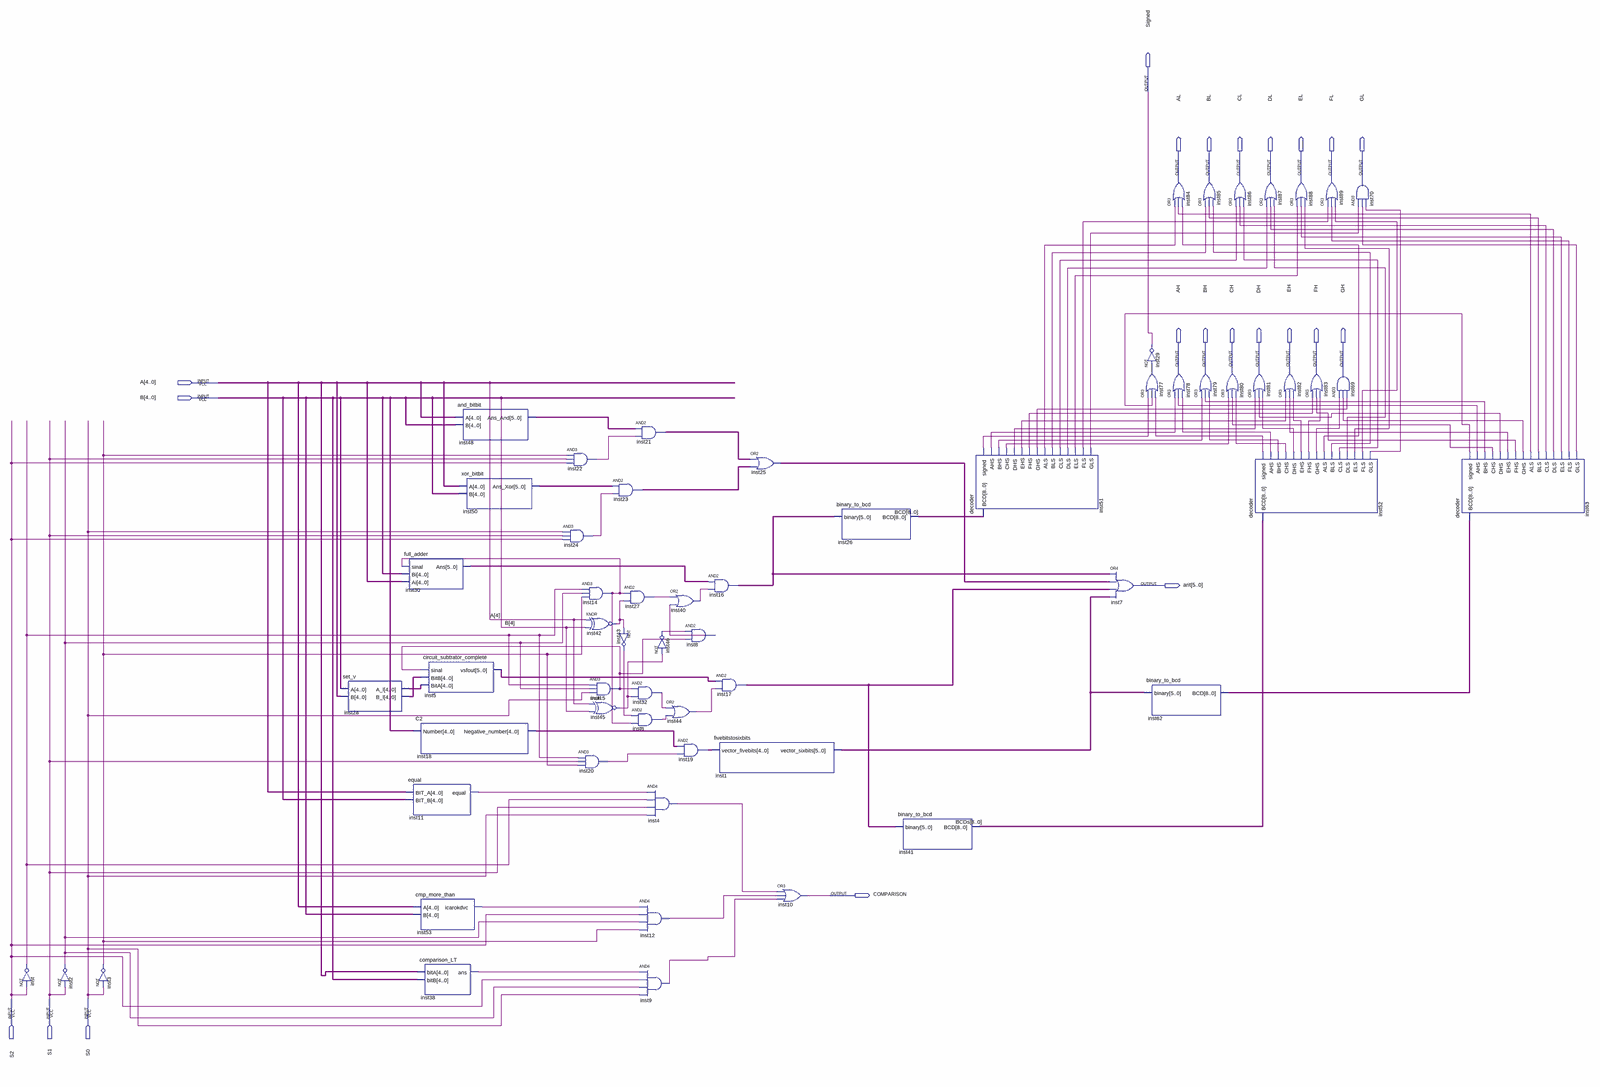
[diagram p0: schematic sheet, whole]
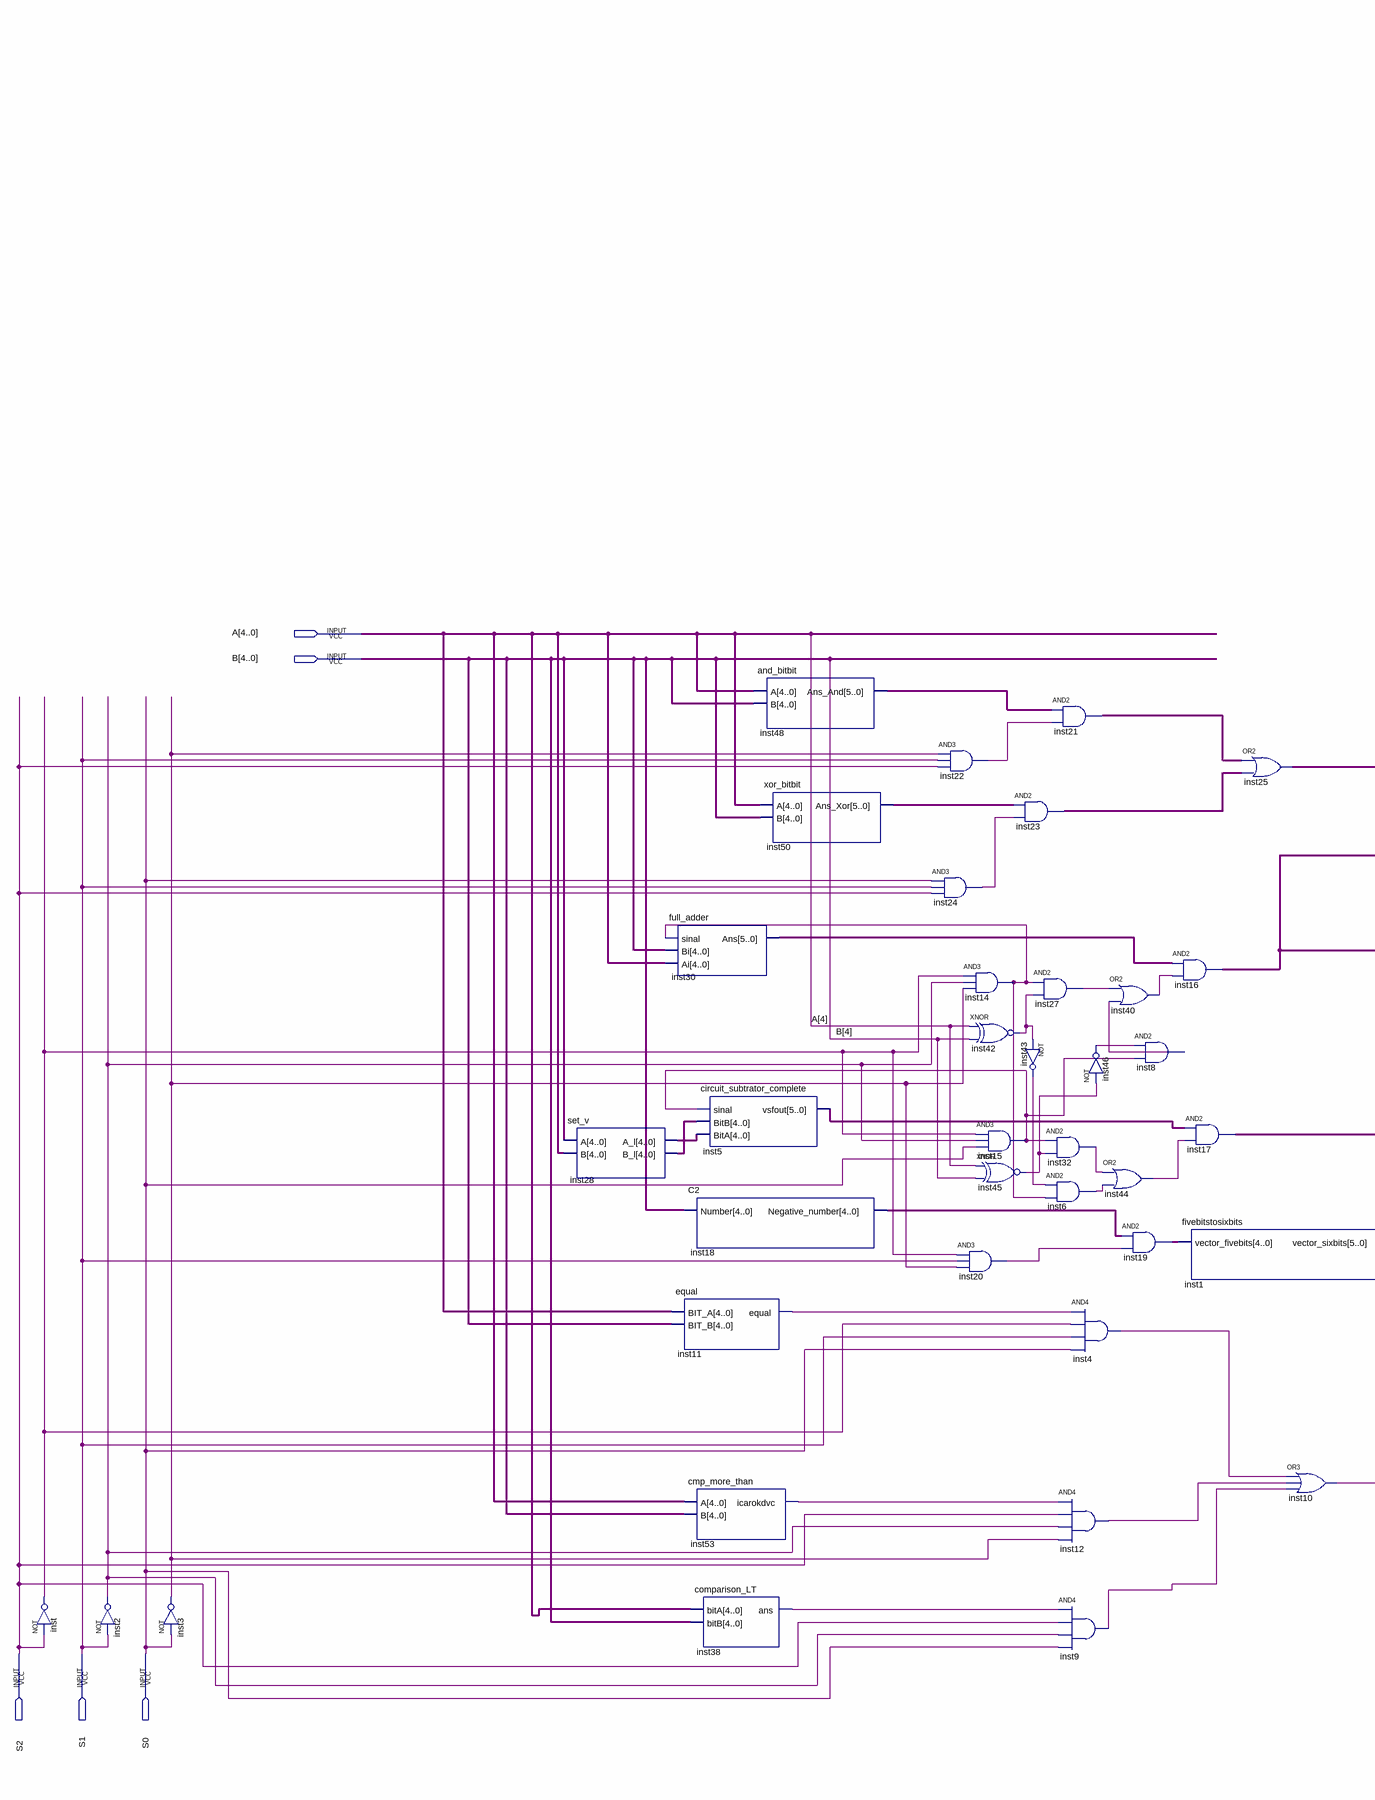
[diagram p1: schematic sheet, left part]
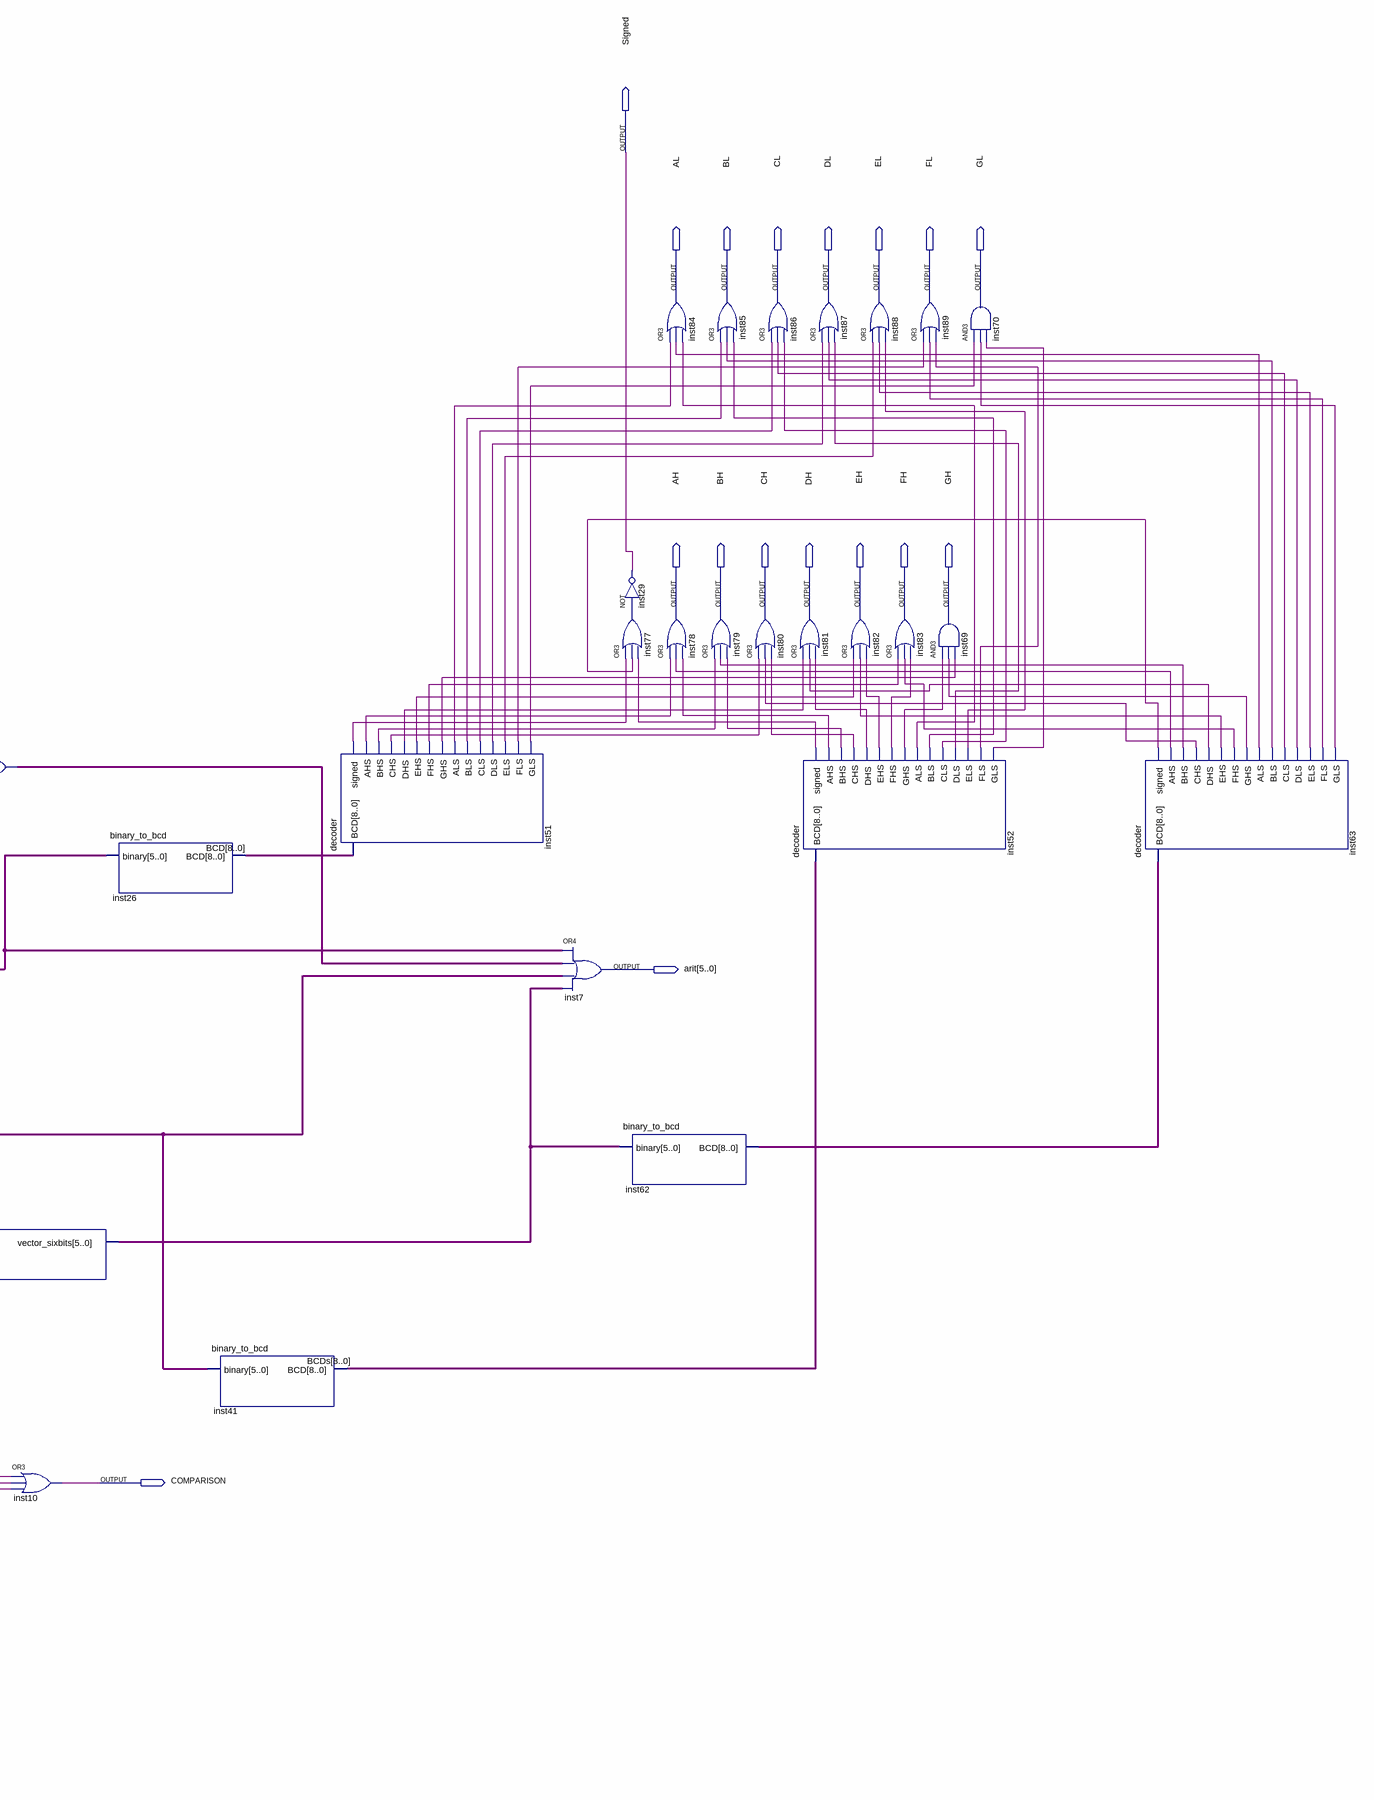
[diagram p2: schematic sheet, right part]
// Quartus schematic ula.bdf as structural Verilog: 61 symbols, 22 pins
module ula (
  input  [4:0] A,
  input  [4:0] B,
  input  S2,
  input  S1,
  input  S0,
  output Signed,
  output AL,
  output BL,
  output CL,
  output DL,
  output EL,
  output FL,
  output GL,
  output AH,
  output BH,
  output CH,
  output DH,
  output EH,
  output FH,
  output GH,
  output [5:0] arit,
  output COMPARISON
);

  wire inst2_out, inst3_out, inst4_out, inst6_out, inst8_out, inst9_out, inst11_equal, inst12_out,
       inst14_out, inst15_out, inst20_out, inst22_out, inst24_out, inst27_out, inst32_out, inst38_ans,
       inst40_out, inst42_out, inst43_out, inst44_out, inst45_out, inst46_out, inst51_ahs, inst51_als,
       inst51_bhs, inst51_bls, inst51_chs, inst51_cls, inst51_dhs, inst51_dls, inst51_ehs, inst51_els,
       inst51_fhs, inst51_fls, inst51_ghs, inst51_gls, inst51_signed, inst52_ahs, inst52_als, inst52_bhs,
       inst52_bls, inst52_chs, inst52_cls, inst52_dhs, inst52_dls, inst52_ehs, inst52_els, inst52_fhs,
       inst52_fls, inst52_ghs, inst52_gls, inst52_signed, inst53_icarokdvc, inst63_ahs, inst63_als,
       inst63_bhs, inst63_bls, inst63_chs, inst63_cls, inst63_dhs, inst63_dls, inst63_ehs, inst63_els,
       inst63_fhs, inst63_fls, inst63_ghs, inst63_gls, inst63_signed, inst77_out, inst_out;
  wire [4:0] inst18_negative_number, inst19_out, inst28_a_l, inst28_b_l;
  wire [5:0] inst1_vector_sixbits, inst5_vsfout, inst16_out, inst17_out, inst21_out, inst23_out, inst25_out,
       inst30_ans, inst48_ans_and, inst50_ans_xor;
  wire [8:0] BCD, BCDs, inst62_bcd;

  not inst (inst_out, S2);
  not inst2 (inst2_out, S1);
  not inst3 (inst3_out, S0);
  set_v inst28 (.A(B), .B(A), .A_l(inst28_a_l), .B_l(inst28_b_l));
  full_adder inst30 (.sinal(inst14_out), .Bi(B), .Ai(A), .Ans(inst30_ans));
  circuit_subtrator_complete inst5 (.sinal(inst15_out), .BitB(inst28_b_l), .BitA(inst28_a_l), .vsfout(inst5_vsfout));
  C2 inst18 (.Number(B), .Negative_number(inst18_negative_number));
  equal inst11 (.BIT_A(A), .BIT_B(B), .equal(inst11_equal));
  cmp_more_than inst53 (.A(A), .B(B), .icarokdvc(inst53_icarokdvc));
  comparison_LT inst38 (.bitA(A), .bitB(B), .ans(inst38_ans));
  and_bitbit inst48 (.A(A), .B(B), .Ans_And(inst48_ans_and));
  xor_bitbit inst50 (.A(A), .B(B), .Ans_Xor(inst50_ans_xor));
  and inst22 (inst22_out, inst3_out, S1, S2);
  and inst24 (inst24_out, S0, S1, S2);
  and inst20 (inst20_out, inst_out, S1, inst3_out);
  and inst14 (inst14_out, inst_out, inst2_out, inst3_out);
  xnor inst42 (inst42_out, A[4], B[4]);
  and inst15 (inst15_out, inst_out, inst2_out, S0);
  xnor inst45 (inst45_out, A[4], B[4]);
  assign inst21_out = inst48_ans_and & {6{inst22_out}};  // AND2 inst21, 6 bits wide
  assign inst23_out = inst50_ans_xor & {6{inst24_out}};  // AND2 inst23, 6 bits wide
  and inst27 (inst27_out, inst14_out, inst42_out);
  not inst43 (inst43_out, inst42_out);
  and inst32 (inst32_out, inst15_out, inst45_out);
  and inst6 (inst6_out, inst43_out, inst14_out);
  and inst12 (inst12_out, inst53_icarokdvc, S2, inst2_out, inst3_out);
  and inst9 (inst9_out, inst38_ans, S2, inst2_out, S0);
  or inst40 (inst40_out, inst27_out, inst8_out);
  not inst46 (inst46_out, inst45_out);
  or inst44 (inst44_out, inst32_out, inst6_out);
  and inst4 (inst4_out, inst11_equal, inst_out, S1, S0);
  and inst8 (inst8_out, inst46_out, inst15_out);
  assign inst19_out = inst18_negative_number & {5{inst20_out}};  // AND2 inst19, 5 bits wide
  assign inst16_out = inst30_ans & {6{inst40_out}};  // AND2 inst16, 6 bits wide
  assign inst17_out = inst5_vsfout & {6{inst44_out}};  // AND2 inst17, 6 bits wide
  fivebitstosixbits inst1 (.vector_fivebits(inst19_out), .vector_sixbits(inst1_vector_sixbits));
  assign inst25_out = inst21_out | inst23_out;  // OR2 inst25, 6 bits wide
  or inst10 (COMPARISON, inst4_out, inst12_out, inst9_out);
  binary_to_bcd inst26 (.binary(inst16_out), .BCD(BCD));
  binary_to_bcd inst41 (.binary(inst17_out), .BCD(BCDs));
  decoder inst51 (
    .BCD(BCD), .\signed (inst51_signed), .AHS(inst51_ahs), .BHS(inst51_bhs), .CHS(inst51_chs),
    .DHS(inst51_dhs), .EHS(inst51_ehs), .FHS(inst51_fhs), .GHS(inst51_ghs), .ALS(inst51_als),
    .BLS(inst51_bls), .CLS(inst51_cls), .DLS(inst51_dls), .ELS(inst51_els), .FLS(inst51_fls), .GLS(inst51_gls));
  assign arit = inst16_out | inst25_out | inst17_out | inst1_vector_sixbits;  // OR4 inst7, 6 bits wide
  not inst29 (Signed, inst77_out);
  or inst77 (inst77_out, inst51_signed, inst63_signed, inst52_signed);
  binary_to_bcd inst62 (.binary(inst1_vector_sixbits), .BCD(inst62_bcd));
  or inst84 (AL, inst51_als, inst63_als, inst52_als);
  or inst78 (AH, inst51_ahs, inst63_ahs, inst52_ahs);
  or inst85 (BL, inst51_bls, inst63_bls, inst52_bls);
  or inst79 (BH, inst51_bhs, inst63_bhs, inst52_bhs);
  or inst80 (CH, inst51_chs, inst63_chs, inst52_chs);
  or inst86 (CL, inst51_cls, inst63_cls, inst52_cls);
  or inst81 (DH, inst51_dhs, inst63_dhs, inst52_dhs);
  decoder inst52 (
    .BCD(BCDs), .\signed (inst52_signed), .AHS(inst52_ahs), .BHS(inst52_bhs), .CHS(inst52_chs),
    .DHS(inst52_dhs), .EHS(inst52_ehs), .FHS(inst52_fhs), .GHS(inst52_ghs), .ALS(inst52_als),
    .BLS(inst52_bls), .CLS(inst52_cls), .DLS(inst52_dls), .ELS(inst52_els), .FLS(inst52_fls), .GLS(inst52_gls));
  or inst87 (DL, inst51_dls, inst63_dls, inst52_dls);
  or inst82 (EH, inst51_ehs, inst63_ehs, inst52_ehs);
  or inst88 (EL, inst51_els, inst63_els, inst52_els);
  or inst83 (FH, inst51_fhs, inst63_fhs, inst52_fhs);
  or inst89 (FL, inst51_fls, inst63_fls, inst52_fls);
  and inst69 (GH, inst52_ghs, inst63_ghs, inst51_ghs);
  and inst70 (GL, inst51_gls, inst63_gls, inst52_gls);
  decoder inst63 (
    .BCD(inst62_bcd), .\signed (inst63_signed), .AHS(inst63_ahs), .BHS(inst63_bhs), .CHS(inst63_chs),
    .DHS(inst63_dhs), .EHS(inst63_ehs), .FHS(inst63_fhs), .GHS(inst63_ghs), .ALS(inst63_als),
    .BLS(inst63_bls), .CLS(inst63_cls), .DLS(inst63_dls), .ELS(inst63_els), .FLS(inst63_fls), .GLS(inst63_gls));
endmodule
